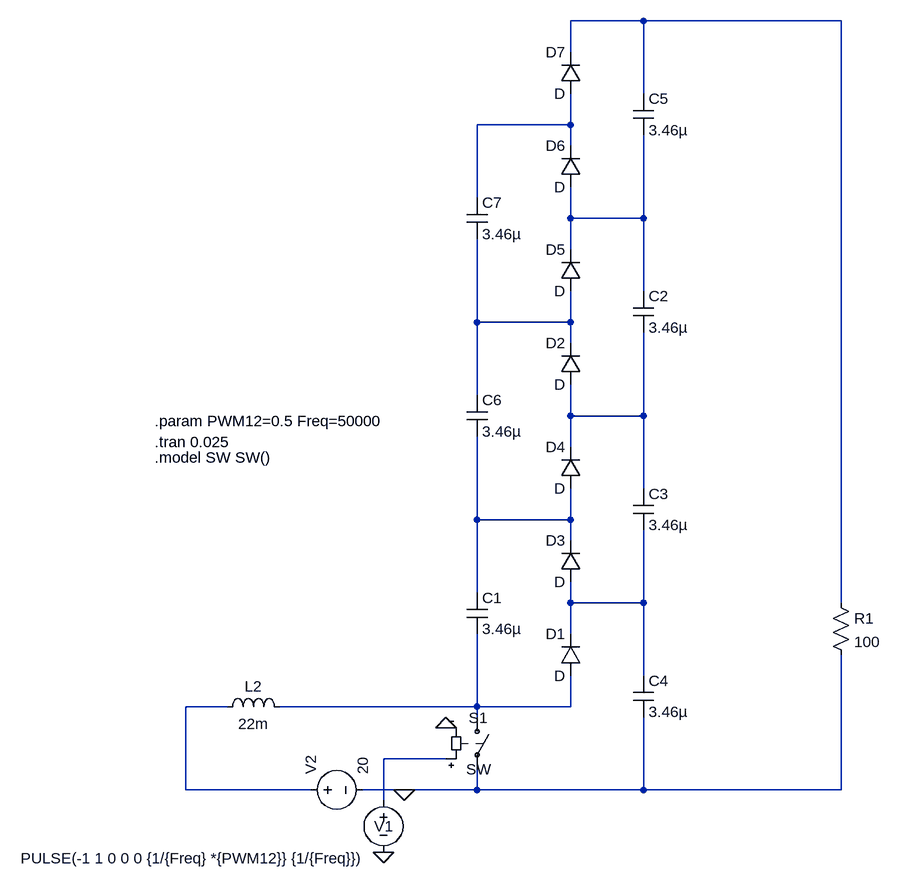
[diagram p0: schematic 3Nxsingle.asc]
3Nxsingle.asc, the LTspice schematic file:
Version 4
SHEET 1 1520 1864
WIRE 704 -208 592 -208
WIRE 1008 -208 704 -208
WIRE 592 -160 592 -208
WIRE 704 -96 704 -208
WIRE 592 -48 592 -96
WIRE 592 -48 448 -48
WIRE 592 -16 592 -48
WIRE 448 64 448 -48
WIRE 592 96 592 48
WIRE 704 96 704 -32
WIRE 704 96 592 96
WIRE 592 144 592 96
WIRE 704 208 704 96
WIRE 448 256 448 128
WIRE 592 256 592 208
WIRE 592 256 448 256
WIRE 592 288 592 256
WIRE 448 368 448 256
WIRE 592 400 592 352
WIRE 704 400 704 272
WIRE 704 400 592 400
WIRE 592 448 592 400
WIRE 704 512 704 400
WIRE 448 560 448 432
WIRE 592 560 592 512
WIRE 592 560 448 560
WIRE 592 592 592 560
WIRE 448 672 448 560
WIRE 592 688 592 656
WIRE 704 688 704 576
WIRE 704 688 592 688
WIRE 1008 688 1008 -208
WIRE 592 736 592 688
WIRE 704 800 704 688
WIRE 64 848 0 848
WIRE 448 848 448 736
WIRE 448 848 144 848
WIRE 592 848 592 800
WIRE 592 848 448 848
WIRE 448 864 448 848
WIRE 400 928 304 928
WIRE 0 976 0 848
WIRE 192 976 0 976
WIRE 336 976 272 976
WIRE 448 976 448 944
WIRE 448 976 336 976
WIRE 704 976 704 864
WIRE 704 976 448 976
WIRE 1008 976 1008 768
WIRE 1008 976 704 976
WIRE 304 992 304 928
FLAG 400 880 0
FLAG 336 976 0
FLAG 304 1072 0
SYMBOL voltage 176 976 R270
WINDOW 123 0 0 Left 2
WINDOW 39 0 0 Left 2
SYMATTR InstName V2
SYMATTR Value 20
SYMBOL sw 448 848 R0
WINDOW 0 -13 17 Left 2
WINDOW 3 -17 96 Left 2
SYMATTR InstName S1
SYMBOL ind 48 864 R270
WINDOW 0 32 56 VTop 2
WINDOW 3 5 56 VBottom 2
SYMATTR InstName L2
SYMATTR Value 22m
SYMBOL cap 432 672 R0
SYMATTR InstName C1
SYMATTR Value 3.46µ
SYMBOL cap 688 800 R0
SYMATTR InstName C4
SYMATTR Value 3.46µ
SYMBOL diode 608 800 R180
WINDOW 0 24 64 Left 2
WINDOW 3 24 0 Left 2
SYMATTR InstName D1
SYMBOL diode 608 656 R180
WINDOW 0 24 64 Left 2
WINDOW 3 24 0 Left 2
SYMATTR InstName D3
SYMBOL diode 608 512 R180
WINDOW 0 24 64 Left 2
WINDOW 3 24 0 Left 2
SYMATTR InstName D4
SYMBOL cap 688 512 R0
SYMATTR InstName C3
SYMATTR Value 3.46µ
SYMBOL res 992 672 R0
SYMATTR InstName R1
SYMATTR Value 100
SYMBOL voltage 304 976 R0
WINDOW 3 -558 105 Left 2
WINDOW 123 0 0 Left 2
WINDOW 39 0 0 Left 2
WINDOW 0 -14 56 Left 2
SYMATTR Value PULSE(-1 1 0 0 0 {1/{Freq} *{PWM12}} {1/{Freq}})
SYMATTR InstName V1
SYMBOL diode 608 352 R180
WINDOW 0 24 64 Left 2
WINDOW 3 24 0 Left 2
SYMATTR InstName D2
SYMBOL diode 608 208 R180
WINDOW 0 24 64 Left 2
WINDOW 3 24 0 Left 2
SYMATTR InstName D5
SYMBOL cap 688 208 R0
SYMATTR InstName C2
SYMATTR Value 3.46µ
SYMBOL diode 608 48 R180
WINDOW 0 24 64 Left 2
WINDOW 3 24 0 Left 2
SYMATTR InstName D6
SYMBOL diode 608 -96 R180
WINDOW 0 24 64 Left 2
WINDOW 3 24 0 Left 2
SYMATTR InstName D7
SYMBOL cap 688 -96 R0
SYMATTR InstName C5
SYMATTR Value 3.46µ
SYMBOL cap 432 368 R0
SYMATTR InstName C6
SYMATTR Value 3.46µ
SYMBOL cap 432 64 R0
SYMATTR InstName C7
SYMATTR Value 3.46µ
TEXT -48 440 Left 2 !.tran 0.025
TEXT -48 464 Left 2 !.model SW SW()
TEXT -48 408 Left 2 !.param PWM12=0.5 Freq=50000

The netlist it stands for:
* 3Nxsingle.asc
V2 N008 0 20
S1 N009 0 N010 0 SW
L2 N008 N009 22m
C1 N006 N009 3.46µ
C4 N007 0 3.46µ
D1 N009 N007 D
D3 N007 N006 D
D4 N006 N005 D
C3 N005 N007 3.46µ
R1 N001 0 100
V1 N010 0 PULSE(-1 1 0 0 0 {1/{Freq} *{PWM12}} {1/{Freq}})
D2 N005 N004 D
D5 N004 N003 D
C2 N003 N005 3.46µ
D6 N003 N002 D
D7 N002 N001 D
C5 N001 N003 3.46µ
C6 N004 N006 3.46µ
C7 N002 N004 3.46µ
.model D D
.lib standard.dio
.tran 0.025
.model SW SW()
.param PWM12=0.5 Freq=50000
.backanno
.end